# Altium schematic sheet ppc_ddr2_0.SchDoc: PowerPC DDR2 Interface
size A3; Date: DO NOT USE, RATHER USE PROJ OPTIONS; DrawnBy: DO NOT USE, RATHER USE PROJ OPTIONS; Engineer: DO NOT USE, RATHER USE PROJ OPTIONS; Organization: DO NOT USE, RATHER USE PROJ OPTIONS; DocumentNumber: DO NOT USE, RATHER USE PROJ OPTIONS; Revision: DO NOT USE, RATHER USE PROJ OPTIONS; SheetNumber: 8; SheetTotal: 29; SCH_Sheet_Filename: ppc_ddr2_0.SchDoc; CurrentTime: DO NOT USE, RATHER USE PROJ OPTIONS; Time: DO NOT USE, RATHER USE PROJ OPTIONS; DocumentFullPathAndName: DO NOT USE, RATHER USE PROJ OPTIONS; DocumentName: DO NOT USE, RATHER USE PROJ OPTIONS; ModifiedDate: DO NOT USE, RATHER USE PROJ OPTIONS; ImagePath: DO NOT USE, RATHER USE PROJ OPTIONS
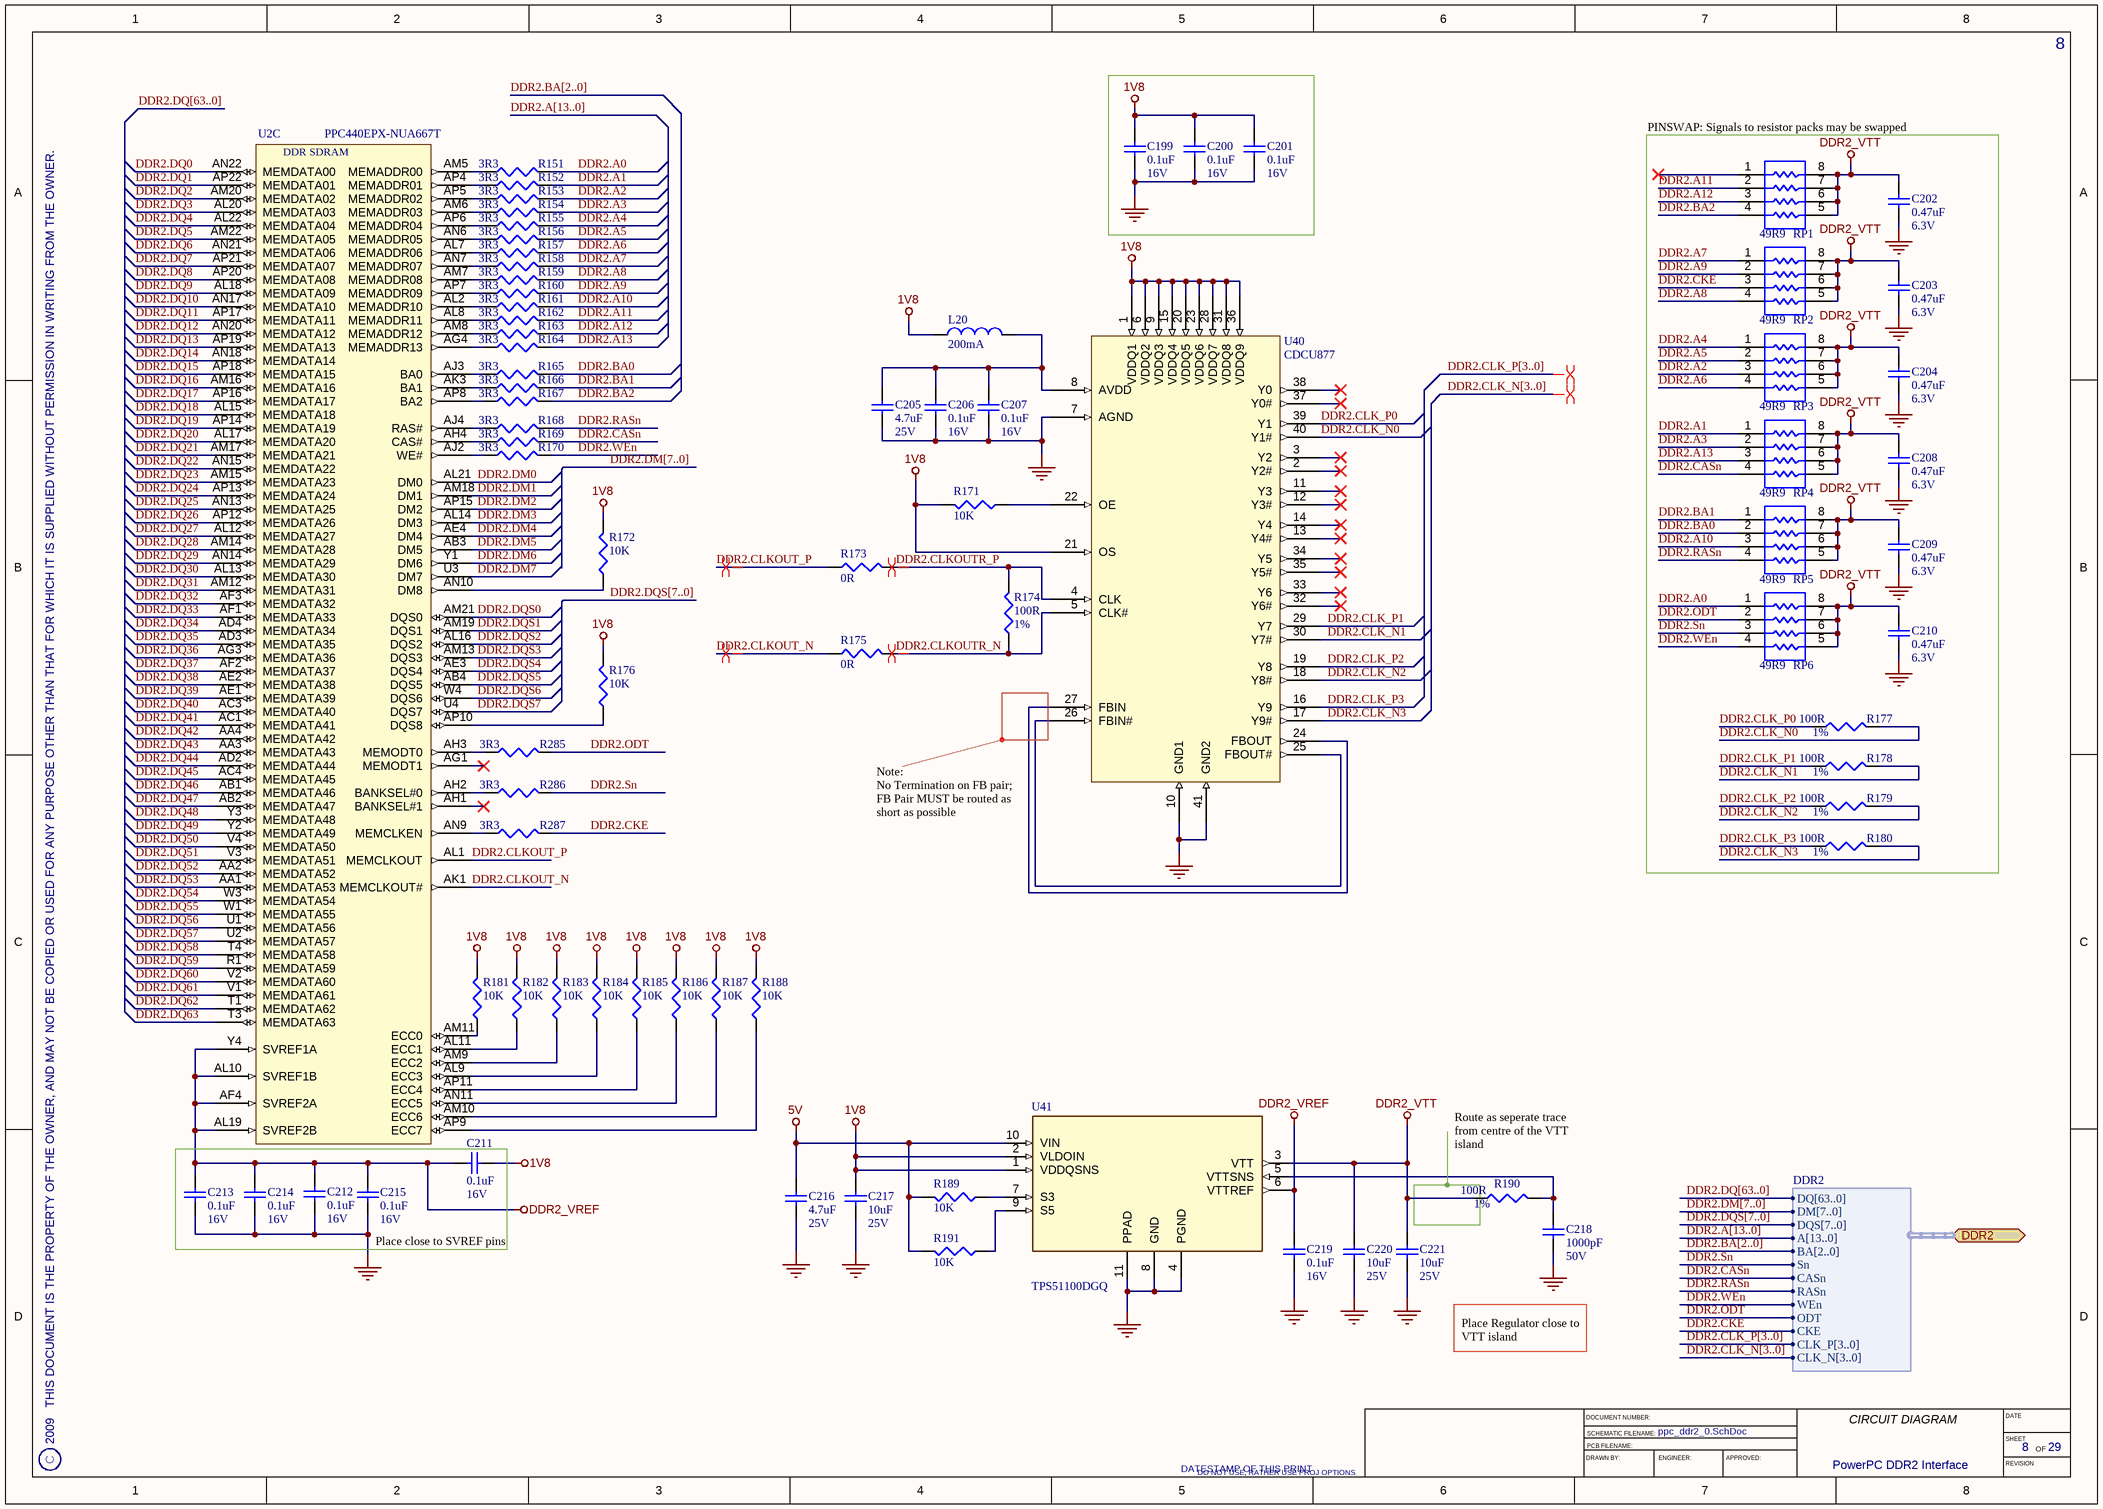
[diagram p0: ppc_ddr2_0.SchDoc]

## Parts
C199  Rating: 16V  [CAPC1005X60L]  (hidden comment: 0.1uF)
C200  Rating: 16V  [CAPC1005X60L]  (hidden comment: 0.1uF)
C201  Rating: 16V  [CAPC1005X60L]  (hidden comment: 0.1uF)
C202  Rating: 6.3V  [CAPC1005X55L]  (hidden comment: 0.47uF)
C203  Rating: 6.3V  [CAPC1005X55L]  (hidden comment: 0.47uF)
C204  Rating: 6.3V  [CAPC1005X55L]  (hidden comment: 0.47uF)
C205  Rating: 25V  [CAPC2012X127L]  (hidden comment: 4.7uF)
C206  Rating: 16V  [CAPC1005X60L]  (hidden comment: 0.1uF)
C207  Rating: 16V  [CAPC1005X60L]  (hidden comment: 0.1uF)
C208  Rating: 6.3V  [CAPC1005X55L]  (hidden comment: 0.47uF)
C209  Rating: 6.3V  [CAPC1005X55L]  (hidden comment: 0.47uF)
C210  Rating: 6.3V  [CAPC1005X55L]  (hidden comment: 0.47uF)
C211  Rating: 16V  [CAPC1005X60L]  (hidden comment: 0.1uF)
C212  Rating: 16V  [CAPC1005X60L]  (hidden comment: 0.1uF)
C213  Rating: 16V  [CAPC1005X60L]  (hidden comment: 0.1uF)
C214  Rating: 16V  [CAPC1005X60L]  (hidden comment: 0.1uF)
C215  Rating: 16V  [CAPC1005X60L]  (hidden comment: 0.1uF)
C216  Rating: 25V  [CAPC2012X127L]  (hidden comment: 4.7uF)
C217  Rating: 25V  [CAPC3225X200L]  (hidden comment: 10uF)
C218  Rating: 50V  [CAPC1005X55L]  (hidden comment: 1000pF)
C219  Rating: 16V  [CAPC1005X60L]  (hidden comment: 0.1uF)
C220  Rating: 25V  [CAPC3225X200L]  (hidden comment: 10uF)
C221  Rating: 25V  [CAPC3225X200L]  (hidden comment: 10uF)
L20  Rating: 200mA  [INDC2012X130L]  (hidden comment: 600R)
R151  3R3  [RESC1005X40L]
R152  3R3  [RESC1005X40L]
R153  3R3  [RESC1005X40L]
R154  3R3  [RESC1005X40L]
R155  3R3  [RESC1005X40L]
R156  3R3  [RESC1005X40L]
R157  3R3  [RESC1005X40L]
R158  3R3  [RESC1005X40L]
R159  3R3  [RESC1005X40L]
R160  3R3  [RESC1005X40L]
R161  3R3  [RESC1005X40L]
R162  3R3  [RESC1005X40L]
R163  3R3  [RESC1005X40L]
R164  3R3  [RESC1005X40L]
R165  3R3  [RESC1005X40L]
R166  3R3  [RESC1005X40L]
R167  3R3  [RESC1005X40L]
R168  3R3  [RESC1005X40L]
R169  3R3  [RESC1005X40L]
R170  3R3  [RESC1005X40L]
R171  10K  [RESC1005X40L]
R172  10K  [RESC1005X40L]
R173  0R  [RESC1005X40L]
R174  Tolerance: 1%  [RESC1005X40L]  (hidden comment: 100R)
R175  0R  [RESC1005X40L]
R176  10K  [RESC1005X40L]
R177  Tolerance: 1%  [RESC1005X40L]  (hidden comment: 100R)
R178  Tolerance: 1%  [RESC1005X40L]  (hidden comment: 100R)
R179  Tolerance: 1%  [RESC1005X40L]  (hidden comment: 100R)
R180  Tolerance: 1%  [RESC1005X40L]  (hidden comment: 100R)
R181  10K  [RESC1005X40L]
R182  10K  [RESC1005X40L]
R183  10K  [RESC1005X40L]
R184  10K  [RESC1005X40L]
R185  10K  [RESC1005X40L]
R186  10K  [RESC1005X40L]
R187  10K  [RESC1005X40L]
R188  10K  [RESC1005X40L]
R189  10K  [RESC1005X40L]
R190  Tolerance: 1%  [RESC1005X40L]  (hidden comment: 100R)
R191  10K  [RESC1005X40L]
R285  3R3  [RESC1005X40L]
R286  3R3  [RESC1005X40L]
R287  3R3  [RESC1005X40L]
RP1  49R9  [RESCAV50P100X200X45-8L]
RP2  49R9  [RESCAV50P100X200X45-8L]
RP3  49R9  [RESCAV50P100X200X45-8L]
RP4  49R9  [RESCAV50P100X200X45-8L]
RP5  49R9  [RESCAV50P100X200X45-8L]
RP6  49R9  [RESCAV50P100X200X45-8L]
U2  PPC440EPX-NUA667T  [TE-PBGA680]  (part C of 11)
U40  CDCU877  [TQFN-40]
U41  TPS51100DGQ  [MSOP_10-N]

## Ports
DDR2 (harness DDR2)

## Harnesses
DDR2: DQ[63..0], DM[7..0], DQS[7..0], A[13..0], BA[2..0], Sn, CASn, RASn, WEn, ODT, CKE, CLK_P[3..0], CLK_N[3..0]

## Nets
1V8: C199.2 C200.2 C201.2 C211.2 C217.2 L20.1 R171.2 R172.2 R176.2 R181.2 R182.2 R183.2 R184.2 R185.2 R186.2 R187.2 R188.2 U40.1(VDDQ1) U40.6(VDDQ2) U40.9(VDDQ3) U40.15(VDDQ4) U40.20(VDDQ5) U40.21(OS) U40.23(VDDQ6) U40.28(VDDQ7) U40.31(VDDQ8) U40.36(VDDQ9) U41.1(VDDQSNS) U41.2(VLDOIN)
5V: C216.2 R189.2 R191.2 U41.10(VIN)
DDR2_VREF: C211.1 C212.2 C213.2 C214.2 C215.2 C219.2 U2.AF4(SVREF2A) U2.AL10(SVREF1B) U2.AL19(SVREF2B) U2.Y4(SVREF1A) U41.6(VTTREF)
DDR2_VTT: C202.2 C203.2 C204.2 C208.2 C209.2 C210.2 C220.2 C221.2 R190.1 RP1.5 RP1.6 RP1.7 RP1.8 RP2.5 RP2.6 RP2.7 RP2.8 RP3.5 RP3.6 RP3.7 RP3.8 RP4.5 RP4.6 RP4.7 RP4.8 RP5.5 RP5.6 RP5.7 RP5.8 RP6.5 RP6.6 RP6.7 RP6.8 U41.3(VTT)
GND: C199.1 C200.1 C201.1 C202.1 C203.1 C204.1 C205.1 C206.1 C207.1 C208.1 C209.1 C210.1 C212.1 C213.1 C214.1 C215.1 C216.1 C217.1 C218.1 C219.1 C220.1 C221.1 U40.7(AGND) U40.10(GND1) U40.41(GND2) U41.4(PGND) U41.8(GND) U41.11(PPAD)
DDR2.A0: R151.2 RP6.1
DDR2.A1: R152.2 RP4.1
DDR2.A2: R153.2 RP3.3
DDR2.A3: R154.2 RP4.2
DDR2.A4: R155.2 RP3.1
DDR2.A5: R156.2 RP3.2
DDR2.A6: R157.2 RP3.4
DDR2.A7: R158.2 RP2.1
DDR2.A8: R159.2 RP2.4
DDR2.A9: R160.2 RP2.2
DDR2.A10: R161.2 RP5.3
DDR2.A11: R162.2 RP1.2
DDR2.A12: R163.2 RP1.3
DDR2.A13: R164.2 RP4.3
DDR2.BA0: R165.2 RP5.2
DDR2.BA1: R166.2 RP5.1
DDR2.BA2: R167.2 RP1.4
DDR2.CASn: R169.2 RP4.4 ; port DDR2.CASn
DDR2.CKE: R287.2 RP2.3 ; port DDR2.CKE
DDR2.CLK_N0: R177.2 U40.40(Y1#)
DDR2.CLK_N1: R178.2 U40.30(Y7#)
DDR2.CLK_N2: R179.2 U40.18(Y8#)
DDR2.CLK_N3: R180.2 U40.17(Y9#)
DDR2.CLK_P0: R177.1 U40.39(Y1)
DDR2.CLK_P1: R178.1 U40.29(Y7)
DDR2.CLK_P2: R179.1 U40.19(Y8)
DDR2.CLK_P3: R180.1 U40.16(Y9)
DDR2.CLKOUT_N: R175.1 U2.AK1(MEMCLKOUT#)
DDR2.CLKOUT_P: R173.1 U2.AL1(MEMCLKOUT)
DDR2.CLKOUTR_N: R174.1 R175.2 U40.5(CLK#)
DDR2.CLKOUTR_P: R173.2 R174.2 U40.4(CLK)
DDR2.DM0: U2.AL21(DM0)
DDR2.DM1: U2.AM18(DM1)
DDR2.DM2: U2.AP15(DM2)
DDR2.DM3: U2.AL14(DM3)
DDR2.DM4: U2.AE4(DM4)
DDR2.DM5: U2.AB3(DM5)
DDR2.DM6: U2.Y1(DM6)
DDR2.DM7: U2.U3(DM7)
DDR2.DQ0: U2.AN22(MEMDATA00)
DDR2.DQ1: U2.AP22(MEMDATA01)
DDR2.DQ2: U2.AM20(MEMDATA02)
DDR2.DQ3: U2.AL20(MEMDATA03)
DDR2.DQ4: U2.AL22(MEMDATA04)
DDR2.DQ5: U2.AM22(MEMDATA05)
DDR2.DQ6: U2.AN21(MEMDATA06)
DDR2.DQ7: U2.AP21(MEMDATA07)
DDR2.DQ8: U2.AP20(MEMDATA08)
DDR2.DQ9: U2.AL18(MEMDATA09)
DDR2.DQ10: U2.AN17(MEMDATA10)
DDR2.DQ11: U2.AP17(MEMDATA11)
DDR2.DQ12: U2.AN20(MEMDATA12)
DDR2.DQ13: U2.AP19(MEMDATA13)
DDR2.DQ14: U2.AN18(MEMDATA14)
DDR2.DQ15: U2.AP18(MEMDATA15)
DDR2.DQ16: U2.AM16(MEMDATA16)
DDR2.DQ17: U2.AP16(MEMDATA17)
DDR2.DQ18: U2.AL15(MEMDATA18)
DDR2.DQ19: U2.AP14(MEMDATA19)
DDR2.DQ20: U2.AL17(MEMDATA20)
DDR2.DQ21: U2.AM17(MEMDATA21)
DDR2.DQ22: U2.AN15(MEMDATA22)
DDR2.DQ23: U2.AM15(MEMDATA23)
DDR2.DQ24: U2.AP13(MEMDATA24)
DDR2.DQ25: U2.AN13(MEMDATA25)
DDR2.DQ26: U2.AP12(MEMDATA26)
DDR2.DQ27: U2.AL12(MEMDATA27)
DDR2.DQ28: U2.AM14(MEMDATA28)
DDR2.DQ29: U2.AN14(MEMDATA29)
DDR2.DQ30: U2.AL13(MEMDATA30)
DDR2.DQ31: U2.AM12(MEMDATA31)
DDR2.DQ32: U2.AF3(MEMDATA32)
DDR2.DQ33: U2.AF1(MEMDATA33)
DDR2.DQ34: U2.AD4(MEMDATA34)
DDR2.DQ35: U2.AD3(MEMDATA35)
DDR2.DQ36: U2.AG3(MEMDATA36)
DDR2.DQ37: U2.AF2(MEMDATA37)
DDR2.DQ38: U2.AE2(MEMDATA38)
DDR2.DQ39: U2.AE1(MEMDATA39)
DDR2.DQ40: U2.AC3(MEMDATA40)
DDR2.DQ41: U2.AC1(MEMDATA41)
DDR2.DQ42: U2.AA4(MEMDATA42)
DDR2.DQ43: U2.AA3(MEMDATA43)
DDR2.DQ44: U2.AD2(MEMDATA44)
DDR2.DQ45: U2.AC4(MEMDATA45)
DDR2.DQ46: U2.AB1(MEMDATA46)
DDR2.DQ47: U2.AB2(MEMDATA47)
DDR2.DQ48: U2.Y3(MEMDATA48)
DDR2.DQ49: U2.Y2(MEMDATA49)
DDR2.DQ50: U2.V4(MEMDATA50)
DDR2.DQ51: U2.V3(MEMDATA51)
DDR2.DQ52: U2.AA2(MEMDATA52)
DDR2.DQ53: U2.AA1(MEMDATA53)
DDR2.DQ54: U2.W3(MEMDATA54)
DDR2.DQ55: U2.W1(MEMDATA55)
DDR2.DQ56: U2.U1(MEMDATA56)
DDR2.DQ57: U2.U2(MEMDATA57)
DDR2.DQ58: U2.T4(MEMDATA58)
DDR2.DQ59: U2.R1(MEMDATA59)
DDR2.DQ60: U2.V2(MEMDATA60)
DDR2.DQ61: U2.V1(MEMDATA61)
DDR2.DQ62: U2.T1(MEMDATA62)
DDR2.DQ63: U2.T3(MEMDATA63)
DDR2.DQS0: U2.AM21(DQS0)
DDR2.DQS1: U2.AM19(DQS1)
DDR2.DQS2: U2.AL16(DQS2)
DDR2.DQS3: U2.AM13(DQS3)
DDR2.DQS4: U2.AE3(DQS4)
DDR2.DQS5: U2.AB4(DQS5)
DDR2.DQS6: U2.W4(DQS6)
DDR2.DQS7: U2.U4(DQS7)
DDR2.ODT: R285.2 RP6.2 ; port DDR2.ODT
DDR2.RASn: R168.2 RP5.4 ; port DDR2.RASn
DDR2.Sn: R286.2 RP6.3 ; port DDR2.Sn
DDR2.WEn: R170.2 RP6.4 ; port DDR2.WEn
NetC205_2: C205.2 C206.2 C207.2 L20.2 U40.8(AVDD)
NetC218_2: C218.2 R190.2 U41.5(VTTSNS)
NetR151_1: R151.1 U2.AM5(MEMADDR00)
NetR152_1: R152.1 U2.AP4(MEMADDR01)
NetR153_1: R153.1 U2.AP5(MEMADDR02)
NetR154_1: R154.1 U2.AM6(MEMADDR03)
NetR155_1: R155.1 U2.AP6(MEMADDR04)
NetR156_1: R156.1 U2.AN6(MEMADDR05)
NetR157_1: R157.1 U2.AL7(MEMADDR06)
NetR158_1: R158.1 U2.AN7(MEMADDR07)
NetR159_1: R159.1 U2.AM7(MEMADDR08)
NetR160_1: R160.1 U2.AP7(MEMADDR09)
NetR161_1: R161.1 U2.AL2(MEMADDR10)
NetR162_1: R162.1 U2.AL8(MEMADDR11)
NetR163_1: R163.1 U2.AM8(MEMADDR12)
NetR164_1: R164.1 U2.AG4(MEMADDR13)
NetR165_1: R165.1 U2.AJ3(BA0)
NetR166_1: R166.1 U2.AK3(BA1)
NetR167_1: R167.1 U2.AP8(BA2)
NetR168_1: R168.1 U2.AJ4(RAS#)
NetR169_1: R169.1 U2.AH4(CAS#)
NetR170_1: R170.1 U2.AJ2(WE#)
NetR171_1: R171.1 U40.22(OE)
NetR172_1: R172.1 U2.AN10(DM8)
NetR176_1: R176.1 U2.AP10(DQS8)
NetR181_1: R181.1 U2.AM11(ECC0)
NetR182_1: R182.1 U2.AL11(ECC1)
NetR183_1: R183.1 U2.AM9(ECC2)
NetR184_1: R184.1 U2.AL9(ECC3)
NetR185_1: R185.1 U2.AP11(ECC4)
NetR186_1: R186.1 U2.AN11(ECC5)
NetR187_1: R187.1 U2.AM10(ECC6)
NetR188_1: R188.1 U2.AP9(ECC7)
NetR189_1: R189.1 U41.7(S3)
NetR191_1: R191.1 U41.9(S5)
NetR285_1: R285.1 U2.AH3(MEMODT0)
NetR286_1: R286.1 U2.AH2(BANKSEL#0)
NetR287_1: R287.1 U2.AN9(MEMCLKEN)
NetU40_24: U40.24(FBOUT) U40.27(FBIN)
NetU40_25: U40.25(FBOUT#) U40.26(FBIN#)

Not connected (* = marked no-connect by the designer): RP1 1*; U2 AG1(MEMODT1)* AH1(BANKSEL#1)*; U40 2(Y2#)* 3(Y2)* 11(Y3)* 12(Y3#)* 13(Y4#)* 14(Y4)* 32(Y6#)* 33(Y6)* 34(Y5)* 35(Y5#)* 37(Y0#)* 38(Y0)*

## Buses and harness runs
bus DDR2.A[13..0]
bus DDR2.BA[2..0]
bus DDR2.CLK_N[3..0]
bus DDR2.CLK_P[3..0]
bus DDR2.DM[7..0]
bus DDR2.DQ[63..0]
bus DDR2.DQS[7..0]

## Layout directives
differential pair: (no net found under the mark), DDR2.CLKOUT_N, DDR2.CLKOUT_P, DDR2.CLKOUTR_N, DDR2.CLKOUTR_P

## Notes on the sheet
- (near RP1) PINSWAP: Signals to resistor packs may be swapped
- Note:
  No Termination on FB pair;
  FB Pair MUST be routed as short as possible
- Route as seperate trace from centre of the VTT island
- (near C215) Place close to SVREF pins
- Place Regulator close to VTT island
- 2009   THIS DOCUMENT IS THE PROPERTY OF THE OWNER, AND MAY NOT BE COPIED OR USED FOR ANY PURPOSE OTHER THAN THAT FOR WHICH IT IS SUPPLIED WITHOUT PERMISSION IN WRITING FROM THE OWNER.
- C
- DATESTAMP OF THIS PRINT
- DRAWN BY:
- DOCUMENT NUMBER:
- SCHEMATIC FILENAME:
- PCB FILENAME:
- ENGINEER:
- APPROVED:
- CIRCUIT DIAGRAM
- DATE
- SHEET
- REVISION
- OF
- (in symbol IC-CPU-1, part C) DDR SDRAM

## Library data of the parts
C199-C201 C206 C207 C211-C215 C219 = CAP-CER-1: 0.1uF, Ceramic Capacitor; Manufacturer: VENKEL; PartNum: C0402X7R160-104KN; Tolerance: 10%; Dielectric: X7R; POD number: CAP-CER-1; Value: 0.1uF; RoHS: Y; Sort Value: 0.1; Category: Capacitors; Subcategory: Ceramic
C202-C204 C208-C210 = CAP-CER-7: 0.47uF, Ceramic Capacitor; Manufacturer: MURATA; PartNum: GRM155R60J474KE19; Tolerance: 10%; Dielectric: X5R; POD number: CAP-CER-7; Value: 0.47uF; RoHS: Y; Sort Value: 0.47; Category: Capacitors; Subcategory: Ceramic
C205 C216 = CAP-CER-3: 4.7uF, Ceramic Capacitor; Manufacturer: MURATA; PartNum: GRM21BR61E475KA12K; Tolerance: 10%; Dielectric: X5R; POD number: CAP-CER-3; Value: 4.7uF; RoHS: Y; Sort Value: 4.7; Category: Capacitors; Subcategory: Ceramic
C217 C220 C221 = CAP-CER-5: 10uF, Ceramic Capacitor; Manufacturer: MURATA; PartNum: GRM32DR61E106KA12L; Tolerance: 10%; Dielectric: X5R; POD number: CAP-CER-5; Value: 10uF; RoHS: Y; Sort Value: 100; Category: Capacitors; Subcategory: Ceramic
C218 = CAP-CER-4: 1000pF, Ceramic Capacitor; Manufacturer: MURATA; PartNum: GRM155R61H102KA01D; Tolerance: 10%; Dielectric: X5R; POD number: CAP-CER-4; Value: 1000pF; RoHS: Y; Sort Value: 0.0001; Category: Capacitors; Subcategory: Ceramic
L20 = IND-FB-0: 600 Ohm, Chip Ferrite Bead; Manufacturer: Murata; PartNum: BLM21BD601SN1; DC Res: 0.35R; Tolerance: 25%; POD number: IND-FB-0; RoHS: Y; Value: 600R; Sort Value: 600; Category: Inductors; Subcategory: FerriteBead
R151-R170 R285-R287 = RES-TF-24: 3R3, 1.1mm x 0.5mm, Thick Film Resistor; Manufacturer: ROYALOHM; PartNum: 0402WGJ330KT1E; Tolerance: 5%; Rating: 0.0625W; POD number: RES-TF-24; Value: 3R3; Sort Value: 3R3; Category: Resistors; Subcategory: ThickFilm; HelpURL: *.pdf
R171 R172 R176 R181-R189 R191 = RES-TF-5: 10K, 1.1mm x 0.5mm, Thick Film Resistor; Manufacturer: ROYALOHM; PartNum: 0402WGJ0103T1E; Tolerance: 5%; Rating: 0.0625W; POD number: RES-TF-5; Value: 10K; Sort Value: 10000; Category: Resistors; Subcategory: ThickFilm; HelpURL: *.pdf
R173 R175 = RES-TF-0: 0R, 1.1mm x 0.5mm, Thick Film Resistor; Manufacturer: ROYALOHM; PartNum: 0402WG00000T1E; Tolerance: 0%; Rating: 0.0625W; POD number: RES-TF-0; Value: 0R; Sort Value: 0; Category: Resistors; Subcategory: ThickFilm; HelpURL: *.pdf
R174 R177-R180 R190 = RES-TF-14: 100R, 1.1mm x 0.5mm, Thick Film Resistor; Manufacturer: ROYALOHM; PartNum: 0402WGF0101T1E; Rating: 0.0625W; POD number: RES-TF-14; Value: 100R; Sort Value: 1000; Category: Resistors; Subcategory: ThickFilm; HelpURL: *.pdf
RP1-RP6 = RES-TF-39: 4-Wide, Isolated, Thick Film Resistor Network; Manufacturer: ROYALOHM; PartNum: 4D02WGJ0510B1E; Tolerance: 1%; Rating: 0.0625W; POD number: RES-TF-39; Value: 49R9; Sort Value: 49.9; Category: Resistors; Subcategory: ThickFilm
U2 = IC-CPU-1: 667MHz, non-RoHS, PPC440EPx uProcessor; Manufacturer: Applied Micro; POD number: IC-CPU-1; PartNum: PPC440EPX-NUA667T; RoHS: Y; Category: IC; Subcategory: CPU
U40 = IC-LOG-15: SSTL Zero-Delay Clock Buffer; Manufacturer: Texas Instruments; POD number: IC-LOG-15; PartNum: CDCU877; RoHS: Y; Category: IC; Subcategory: Logic
U41 = IC-REG-6: 3A Sink/Source Regulator; Manufacturer: Texas Instruments; POD number: IC-REG-6; PartNum: TPS51100DGQ; RoHS: Y; Category: IC; Subcategory: Regulators